# Altium schematic sheet power_esp32.SchDoc
size B; SheetNumber: 5; SheetTotal: 5
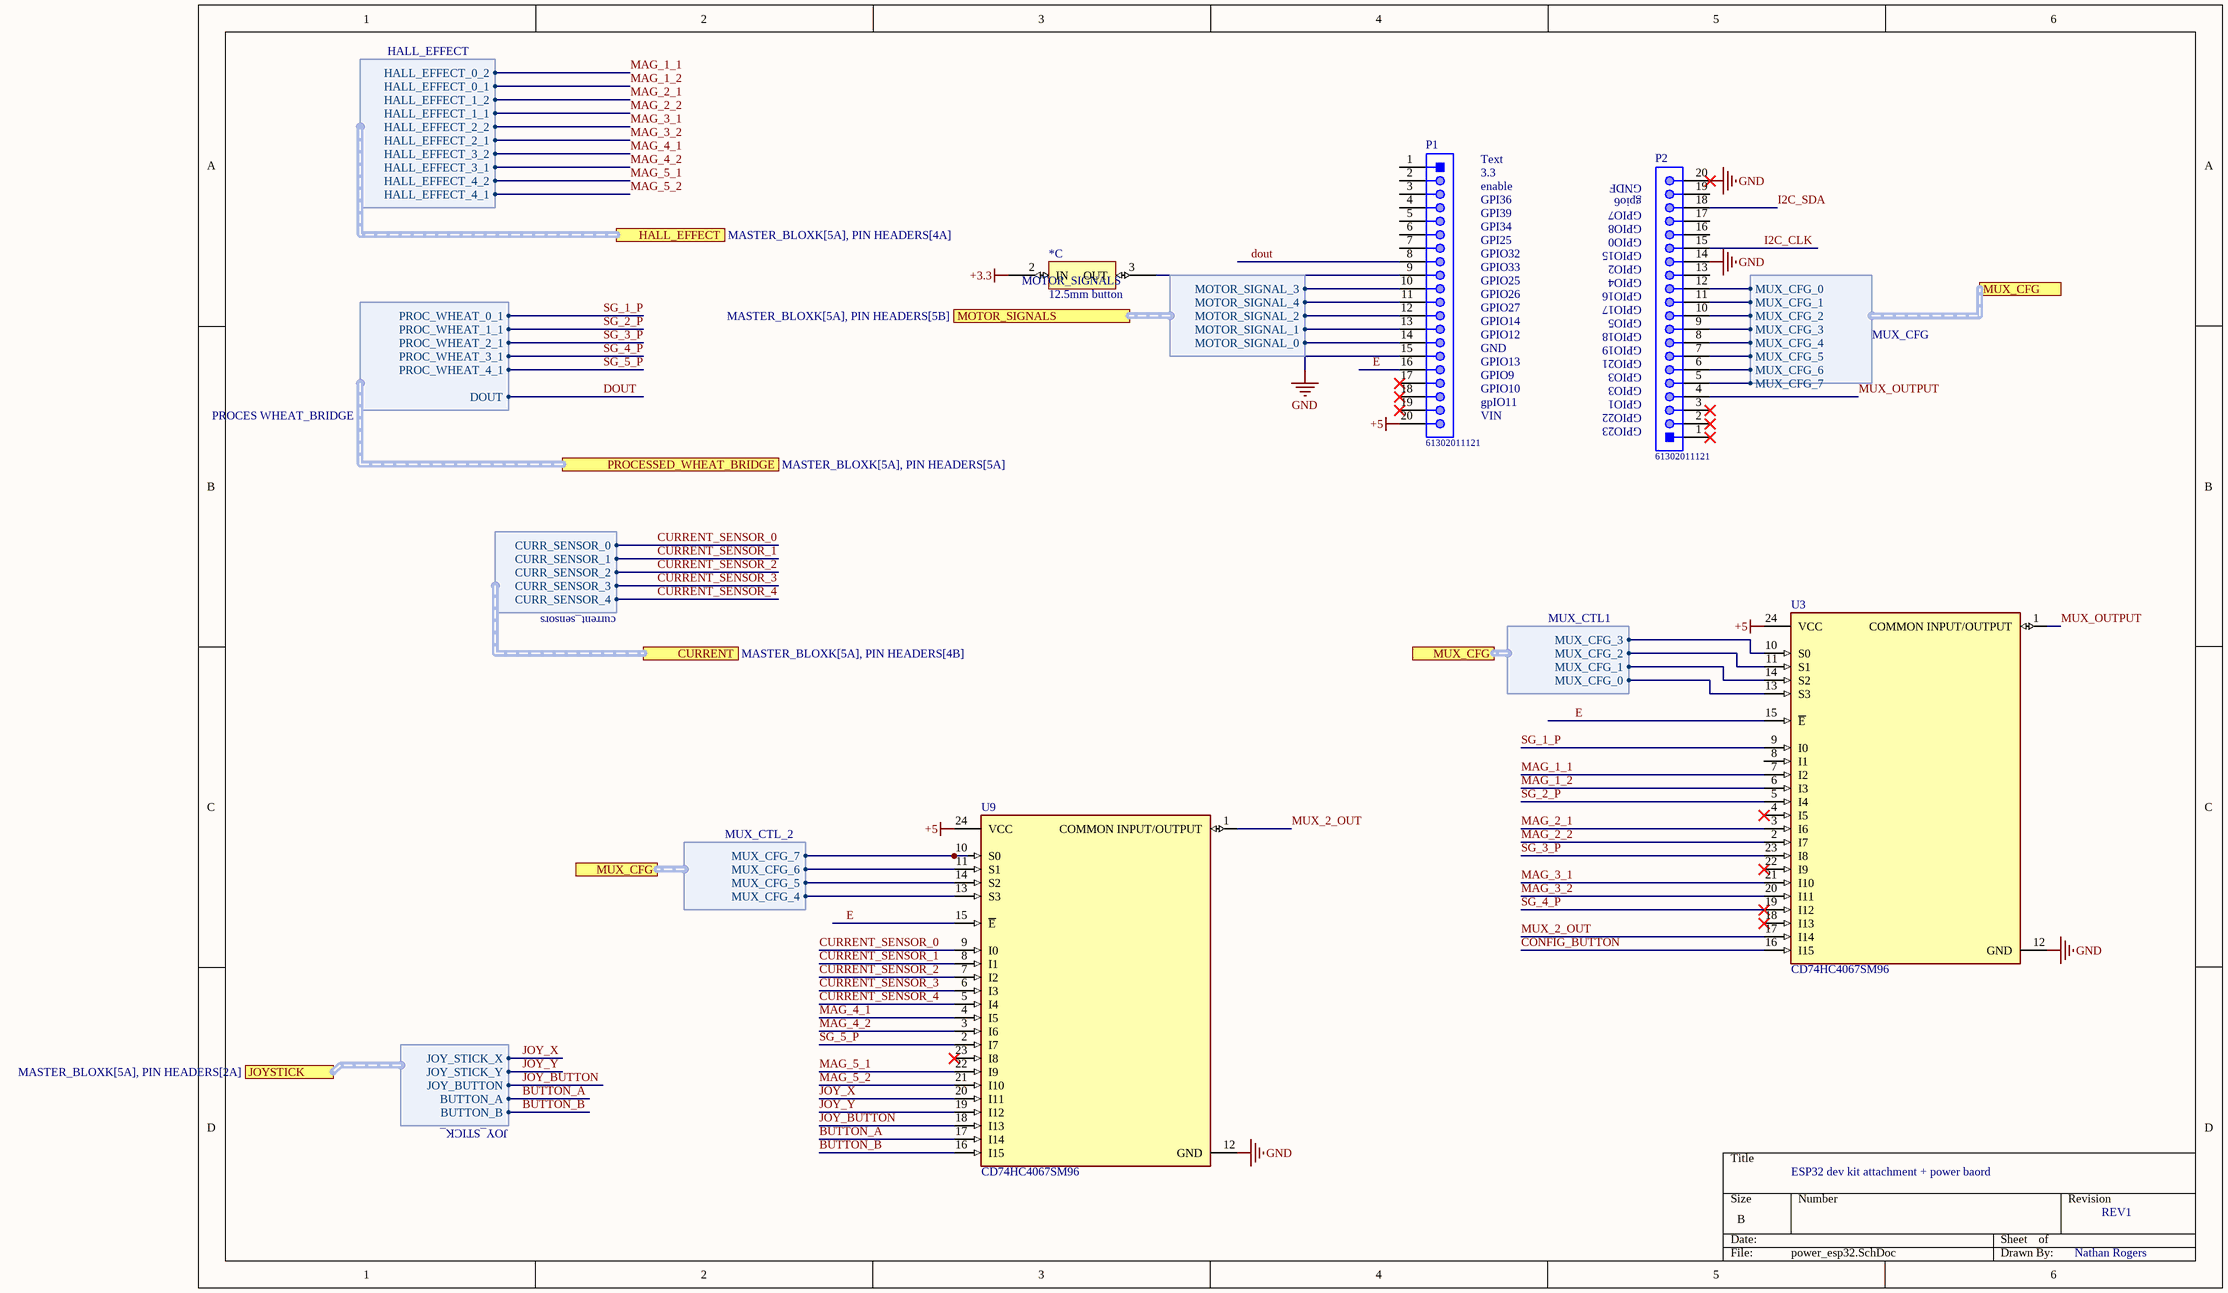
[diagram p0: power_esp32.SchDoc]

## Parts
*  12.5mm button  [12.5mm button-Footprint-1]  (part C of 3)
P1  61302011121  [61302011121]
P2  61302011121  [61302011121]
U3  CD74HC4067SM96  [FP-DB0024A-IPC_C]
U9  CD74HC4067SM96  [FP-DB0024A-IPC_C]

## Ports
CURRENT (harness current_sensors, see MASTER_BLOXK[5A], PIN HEADERS[4B]), HALL_EFFECT (harness HALL_EFFECT, see MASTER_BLOXK[5A], PIN HEADERS[4A]), JOYSTICK (harness JOY_STICK_, see MASTER_BLOXK[5A], PIN HEADERS[2A]), MOTOR_SIGNALS (harness MOTOR_SIGNALS, see MASTER_BLOXK[5A], PIN HEADERS[5B]), MUX_CFG (harness MUX_CFG), MUX_CFG (harness MUX_ctl1), MUX_CFG (harness MUX_CTL_2), PROCESSED_WHEAT_BRIDGE (harness PROCES WHEAT_BRIDGE, see MASTER_BLOXK[5A], PIN HEADERS[5A])

## Harnesses
MUX_CTL1: MUX_CFG_0, MUX_CFG_1, MUX_CFG_2, MUX_CFG_3
HALL_EFFECT: HALL_EFFECT_2_1, HALL_EFFECT_3_2, HALL_EFFECT_3_1, HALL_EFFECT_4_2, HALL_EFFECT_4_1, HALL_EFFECT_2_2, HALL_EFFECT_1_1, HALL_EFFECT_1_2, HALL_EFFECT_0_1, HALL_EFFECT_0_2
PROCES WHEAT_BRIDGE: PROC_WHEAT_0_1, PROC_WHEAT_1_1, PROC_WHEAT_2_1, PROC_WHEAT_3_1, PROC_WHEAT_4_1, DOUT
MUX_CTL_2: MUX_CFG_4, MUX_CFG_5, MUX_CFG_6, MUX_CFG_7
MOTOR_SIGNALS: MOTOR_SIGNAL_0, MOTOR_SIGNAL_1, MOTOR_SIGNAL_2, MOTOR_SIGNAL_3, MOTOR_SIGNAL_4
MUX_CFG: MUX_CFG_0, MUX_CFG_1, MUX_CFG_2, MUX_CFG_3, MUX_CFG_4, MUX_CFG_5, MUX_CFG_6, MUX_CFG_7
current_sensors: CURR_SENSOR_0, CURR_SENSOR_1, CURR_SENSOR_2, CURR_SENSOR_3, CURR_SENSOR_4
JOY_STICK_: JOY_STICK_X, JOY_STICK_Y, JOY_BUTTON, BUTTON_A, BUTTON_B

## Nets
+3.3: *.2(IN)
+5: P1.20 U3.24(VCC) U9.24(VCC)
GND: P1.15 P2.14 P2.20 U3.12(GND) U9.12(GND)
BUTTON_A: U9.17(I14) ; port JOYSTICK.BUTTON_A
BUTTON_B: U9.16(I15) ; port JOYSTICK.BUTTON_B
CONFIG_BUTTON: U3.16(I15)
CURRENT_SENSOR_0: U9.9(I0) ; port CURRENT.CURR_SENSOR_0
CURRENT_SENSOR_1: U9.8(I1) ; port CURRENT.CURR_SENSOR_1
CURRENT_SENSOR_2: U9.7(I2) ; port CURRENT.CURR_SENSOR_2
CURRENT_SENSOR_3: U9.6(I3) ; port CURRENT.CURR_SENSOR_3
CURRENT_SENSOR_4: U9.5(I4) ; port CURRENT.CURR_SENSOR_4
dout: P1.8 ; port PROCESSED_WHEAT_BRIDGE.DOUT
E: P1.16 U3.15(~{E}) U9.15(~{E})
I2C_CLK: P2.15
I2C_SDA: P2.18
JOY_BUTTON: U9.18(I13) ; port JOYSTICK.JOY_BUTTON
JOY_X: U9.20(I11) ; port JOYSTICK.JOY_STICK_X
JOY_Y: U9.19(I12) ; port JOYSTICK.JOY_STICK_Y
MAG_1_1: U3.7(I2) ; port HALL_EFFECT.HALL_EFFECT_0_2
MAG_1_2: U3.6(I3) ; port HALL_EFFECT.HALL_EFFECT_0_1
MAG_2_1: U3.3(I6) ; port HALL_EFFECT.HALL_EFFECT_1_2
MAG_2_2: U3.2(I7) ; port HALL_EFFECT.HALL_EFFECT_1_1
MAG_3_1: U3.21(I10) ; port HALL_EFFECT.HALL_EFFECT_2_2
MAG_3_2: U3.20(I11) ; port HALL_EFFECT.HALL_EFFECT_2_1
MAG_4_1: U9.4(I5) ; port HALL_EFFECT.HALL_EFFECT_3_2
MAG_4_2: U9.3(I6) ; port HALL_EFFECT.HALL_EFFECT_3_1
MAG_5_1: U9.22(I9) ; port HALL_EFFECT.HALL_EFFECT_4_2
MAG_5_2: U9.21(I10) ; port HALL_EFFECT.HALL_EFFECT_4_1
MUX_2_OUT: U3.17(I14) U9.1(COMMON_INPUT/OUTPUT)
MUX_OUTPUT: P2.4 U3.1(COMMON_INPUT/OUTPUT)
SG_1_P: U3.9(I0) ; port PROCESSED_WHEAT_BRIDGE.PROC_WHEAT_0_1
SG_2_P: U3.5(I4) ; port PROCESSED_WHEAT_BRIDGE.PROC_WHEAT_1_1
SG_3_P: U3.23(I8) ; port PROCESSED_WHEAT_BRIDGE.PROC_WHEAT_2_1
SG_4_P: U3.19(I12) ; port PROCESSED_WHEAT_BRIDGE.PROC_WHEAT_3_1
SG_5_P: U9.2(I7) ; port PROCESSED_WHEAT_BRIDGE.PROC_WHEAT_4_1
Net*_3: *.3(OUT) P1.9
NetP1_10: P1.10 ; port MOTOR_SIGNALS.MOTOR_SIGNAL_3
NetP1_11: P1.11 ; port MOTOR_SIGNALS.MOTOR_SIGNAL_4
NetP1_12: P1.12 ; port MOTOR_SIGNALS.MOTOR_SIGNAL_2
NetP1_13: P1.13 ; port MOTOR_SIGNALS.MOTOR_SIGNAL_1
NetP1_14: P1.14 ; port MOTOR_SIGNALS.MOTOR_SIGNAL_0
NetP2_5: P2.5 U9.10(S0) ; port MUX_CFG.MUX_CFG_7
NetP2_6: P2.6 U9.11(S1) ; port MUX_CFG.MUX_CFG_6
NetP2_7: P2.7 U9.14(S2) ; port MUX_CFG.MUX_CFG_5
NetP2_8: P2.8 U9.13(S3) ; port MUX_CFG.MUX_CFG_4
NetP2_9: P2.9 U3.10(S0) ; port MUX_CFG.MUX_CFG_3
NetP2_10: P2.10 U3.11(S1) ; port MUX_CFG.MUX_CFG_2
NetP2_11: P2.11 U3.14(S2) ; port MUX_CFG.MUX_CFG_1
NetP2_12: P2.12 U3.13(S3) ; port MUX_CFG.MUX_CFG_0

Not connected (* = marked no-connect by the designer): P1 1 2 3 4 5 6 7 17* 18* 19*; P2 1* 2* 3* 13 16 17 19; U3 4(I5)* 8(I1) 18(I13)* 22(I9)*; U9 23(I8)*

## Notes on the sheet
- Text
- 3.3
- enable
- GPI36
- GPI39
- GPI34
- (near P2) GPIO0
- (near P2) GPIO8
- (near P2) GPIO7
- (near P2) gpio6
- (near P2) GNDF
- GPI25
- GPIO32
- GPIO33
- GPIO25
- GPIO26
- (near P2) GPIO17
- (near P2) GPIO16
- (near P2) GPIO4
- (near P2) GPIO2
- (near P2) GPIO15
- GPIO27
- GPIO14
- GPIO12
- GND
- GPIO13
- (near P2) GPIO3
- (near P2) GPIO21
- (near P2) GPIO19
- (near P2) GPIO18
- (near P2) GPIO5
- GPIO9
- GPIO10
- gpIO11
- VIN
- (near P2) GPIO23
- (near P2) GPIO1
- (near P2) GPIO22
- ESP32 dev kit attachment + power baord
- REV1
- Nathan Rogers

## Library data of the parts
* = CMP-00027-1: Spacer, Round, 1/4 Inch O.D., 1/4 Inch Long, #8 Hole, Phenolic; Throw Configuration: SPST; Actuator Type: Standard; Termination: PC Pin; Mount: Through Hole; Series: -
P1 P2 = CMP-1502-01102-1: THT Vertical Pin Header WR-PHD, Pitch 2.54 mm, Single Row, 20 pins; Manufacturer: Wurth Elektronik; Withstanding Voltage: 500VAC; Gender: Male; Pin Number: 20; Rated Current: 3A; Contact Resistance: 20mOhm; Pitch: 2.54mm; Working Voltage: 250VAC; Publisher: WurthElektronik; Packaging: Bag; Datasheet URL: https://katalog.we-online.de/em/datasheet/6130xx11121.pdf; Row Number: Single; Mounting Technology: THT; Manufacturer URL: http://www.we-online.de; Orientation: Vertical; Package Reference: 61302011121; Part Number: 61302011121; Operating Temperature: -40to105degC
U3 U9 = CMP-04892-000038-1: IC MUX/DEMUX 1X16 24SSOP; Supply Type: Single; High Level Output Current: 25mA; Min Supply Voltage: 2V; Number of Circuits: 16; Max Supply Voltage: 6V; Number of Channels: 1; Turn-On Delay Time: 300ns; Max Supply Current: 8uA; Bandwidth: 89MHz; Turn-Off Delay Time: 290ns; Propagation Delay: 75ns; Logic Function: Multiplexer; On-State Resistance: 160R; Polarity: Non-Inverting; Width: 5.3mm; Case/Package: SSOP; Max Operating Temperature: 125°C; Mount: Surface Mount; Min Operating Temperature: -55°C; REACH SVHC: No SVHC; Contact Plating: Gold; Max Output Current: 25mA; Weight: 0.006081oz; Height: 1.95mm; Package Quantity: 2000; Length: 8.2mm; Lead Free: Lead Free; Operating Supply Current: 8uA; Packaging: Tape and Reel; Series: 74HC; Low Level Output Current: 25mA; Number of Outputs: 1; Termination: SMD/SMT; Number of Inputs: 16; Number of Bits: 16; Radiation Hardening: No; Number of Pins: 24